# EAGLE design aprs_tracker_v4 (EAGLE 9.6.2)

## Sheet 1 of 2
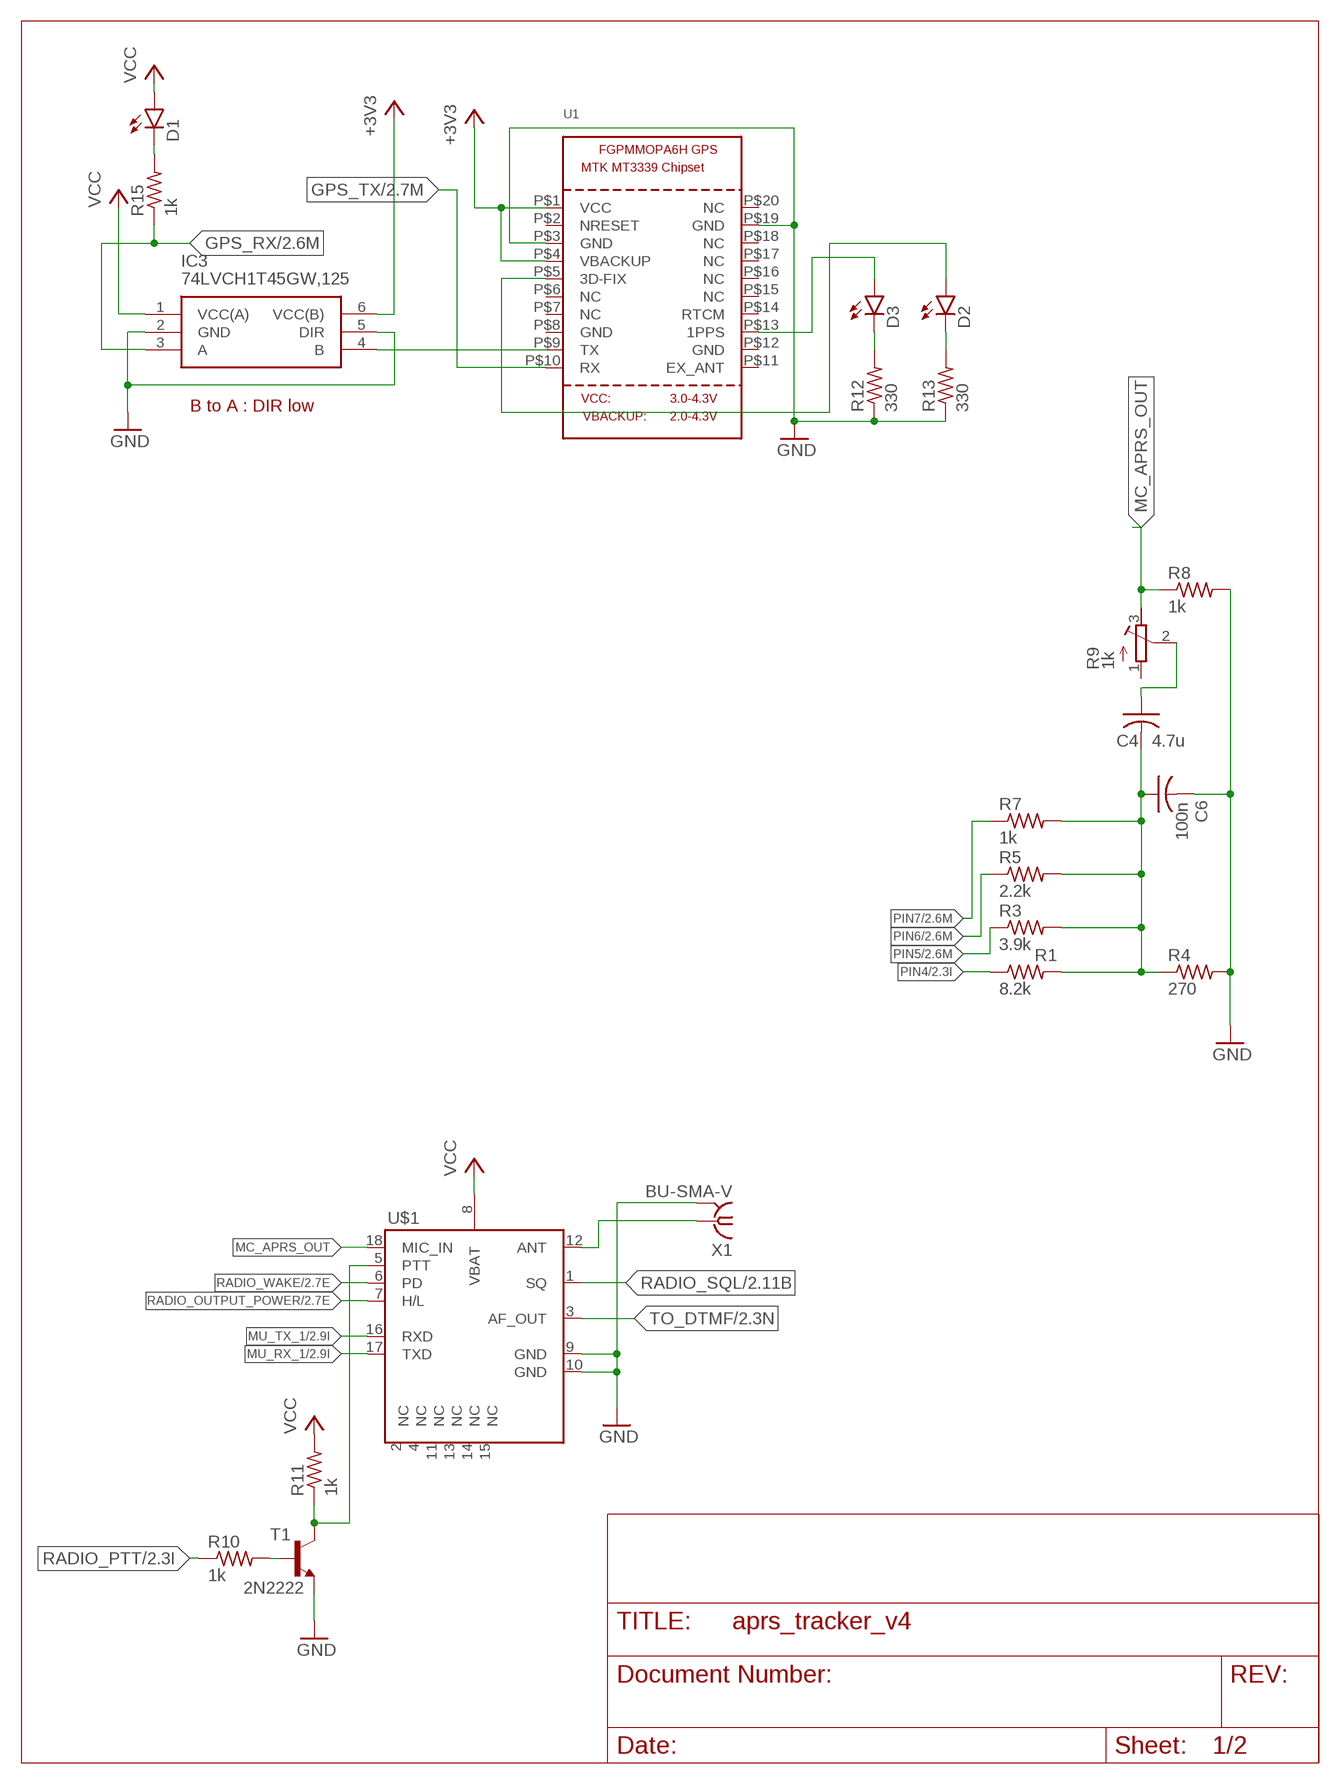
[diagram p0: schematic, sheet 1]

### Parts
C4  4.7u  C-USC0805  [C0805]
C6  100n  C-USC0805  [C0805]
D1  LEDCHIP-LED0805  [CHIP-LED0805]
D2  LEDCHIP-LED0805  [CHIP-LED0805]
D3  LEDCHIP-LED0805  [CHIP-LED0805]
IC3  74LVCH1T45GW,125  [74LVCH1T45GW125]
R1  8.2k  R-US_R0805  [R0805]
R3  3.9k  R-US_R0805  [R0805]
R4  270  R-US_R0805  [R0805]
R5  2.2k  R-US_R0805  [R0805]
R7  1k  R-US_R0805  [R0805]
R8  1k  R-US_R0805  [R0805]
R9  1k  R-TRIMM3339P  [RTRIM3339P]
R10  1k  R-US_R0805  [R0805]
R11  1k  R-US_R0805  [R0805]
R12  330  R-US_R0805  [R0805]
R13  330  R-US_R0805  [R0805]
R15  1k  R-US_R0805  [R0805]
T1  2N2222  [TO92-EBC-OVAL]
U1  GPS_FGPMMOPA6H  [FGPMMOPA6H]
U$1  DRA818A  [DRA818A]
X1  BU-SMA-V  [BU-SMA-V]

### Nets
+3V3 [PWR]: IC3.6(VCC(B)) U1.P$1(VCC) U1.P$4(VBACKUP) ; also sheet 2
A63: D2.A U1.P$5(3D-FIX)
GND [V_bat]: C6.2 IC3.2(GND) IC3.5(DIR) R4.2 R8.2 R12.1 R13.1 T1.E U1.P$3(GND) U1.P$19(GND) U$1.9(GND) U$1.10(GND) X1.2 X1.3 X1.4 X1.5 ; also sheet 2
GPS_RX: IC3.3(A) R15.1 ; also sheet 2
GPS_TX: U1.P$10(RX) ; also sheet 2
MC_APRS_OUT: R8.1 R9.3(E) U$1.18(MIC_IN)
MU_RX_1: U$1.17(TXD) ; also sheet 2
MU_TX_1: U$1.16(RXD) ; also sheet 2
N$1 [50 ohm]: U$1.12(ANT) X1.1
N$3: D1.C R15.2
N$4: IC3.4(B) U1.P$9(TX)
N$10: C4.2 C6.1 R1.2 R3.2 R4.1 R5.2 R7.2
N$11: C4.1 R9.2(S)
N$12: R11.1 T1.C U$1.5(PTT)
N$14: R10.2 T1.B
N$20: D3.C R12.2
N$21: D2.C R13.2
N$23: D3.A U1.P$13(1PPS)
PIN4: R1.1 ; also sheet 2
PIN5: R3.1 ; also sheet 2
PIN6: R5.1 ; also sheet 2
PIN7: R7.1 ; also sheet 2
RADIO_OUTPUT_POWER: U$1.7(H/L) ; also sheet 2
RADIO_PTT: R10.1 ; also sheet 2
RADIO_SQL: U$1.1(SQ) ; also sheet 2
RADIO_WAKE: U$1.6(PD) ; also sheet 2
TO_DTMF: U$1.3(AF_OUT) ; also sheet 2
VCC [PWR]: D1.A IC3.1(VCC(A)) R11.2 U$1.8(VBAT) ; also sheet 2
Unconnected: R9.1(A) U1.P$2(NRESET) U1.P$6(NC) U1.P$7(NC) U1.P$8(GND) U1.P$11(EX_ANT) U1.P$12(GND) U1.P$14(RTCM) U1.P$15(NC) U1.P$16(NC) U1.P$17(NC) U1.P$18(NC) U1.P$20(NC) U$1.2(NC) U$1.4(NC) U$1.11(NC) U$1.13(NC) U$1.14(NC) U$1.15(NC)

### Notes on the sheet
- B to A : DIR low

## Sheet 2 of 2
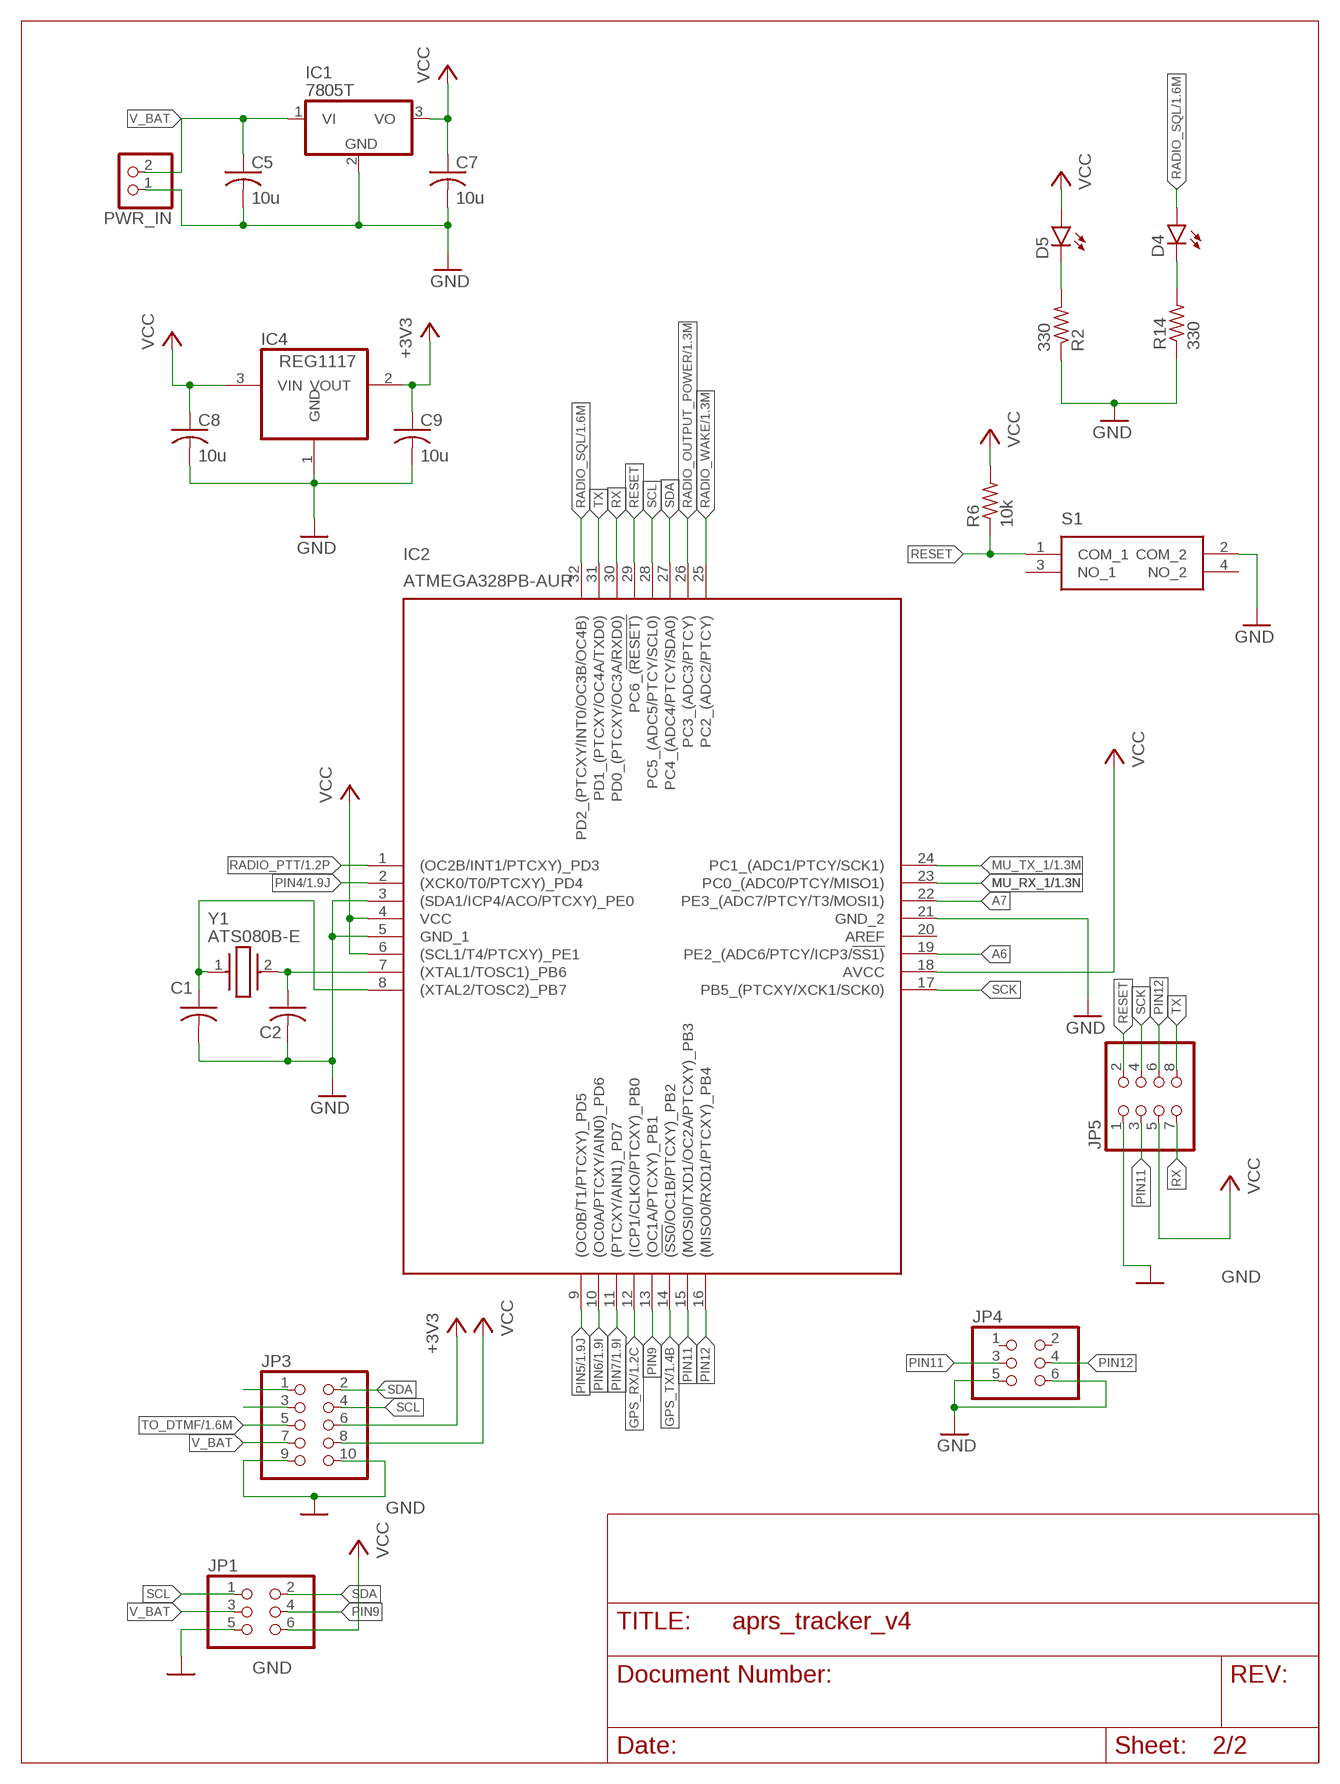
[diagram p1: schematic, sheet 2]

### Parts
C1  C-USC0805  [C0805]
C2  C-USC0805  [C0805]
C5  10u  C-USC0805  [C0805]
C7  10u  C-USC0805  [C0805]
C8  10u  C-USC0805  [C0805]
C9  10u  C-USC0805  [C0805]
D4  LEDCHIP-LED0805  [CHIP-LED0805]
D5  LEDCHIP-LED0805  [CHIP-LED0805]
IC1  7805T  [TO220H]
IC2  ATMEGA328PB-AUR  [QFP80P900X900X120-32N]
IC4  REG1117  [SOT223]
JP1  PINHD-2X3/90  [2X03/90]
JP3  PINHD-2X5  [2X05]
JP4  PINHD-2X3/90  [2X03/90]
JP5  PINHD-2X4  [2X04]
PWR_IN  PINHD-1X2/90  [1X02/90]
R2  330  R-US_R0805  [R0805]
R6  10k  R-US_R0805  [R0805]
R14  330  R-US_R0805  [R0805]
S1  PTS526_SK15_SMTR2_LFS  [PTS526SK15SMTR2LFS]
Y1  ATS080B-E  [ATS080BE]

### Nets
+3V3 [PWR]: C9.1 IC4.2(VOUT) JP3.6 ; also sheet 1
A6: IC2.19(PE2_(ADC6/PTCY/ICP3/!SS1))
A7: IC2.22(PE3_(ADC7/PTCY/T3/MOSI1))
GND [V_bat]: C1.2 C2.2 C5.2 C7.2 C8.2 C9.2 IC1.2(GND) IC2.3((SDA1/ICP4/ACO/PTCXY)_PE0) IC2.5(GND_1) IC2.21(GND_2) IC4.1(GND) JP1.5 JP3.9 JP3.10 JP4.5 JP4.6 JP5.1 PWR_IN.1 R2.1 R14.1 S1.2(COM_2) ; also sheet 1
GPS_RX: IC2.12((ICP1/CLKO/PTCXY)_PB0) ; also sheet 1
GPS_TX: IC2.14((!SS0!/OC1B/PTCXY)_PB2) ; also sheet 1
MU_RX_1: IC2.23(PC0_(ADC0/PTCY/MISO1)) ; also sheet 1
MU_TX_1: IC2.24(PC1_(ADC1/PTCY/SCK1)) ; also sheet 1
N$5: D5.C R2.2
N$6: C1.1 IC2.8((XTAL2/TOSC2)_PB7) Y1.1
N$7: C2.1 IC2.7((XTAL1/TOSC1)_PB6) Y1.2
N$17: JP3.3
N$22: D4.C R14.2
N$25: JP3.1
PIN4: IC2.2((XCK0/T0/PTCXY)_PD4) ; also sheet 1
PIN5: IC2.9((OC0B/T1/PTCXY)_PD5) ; also sheet 1
PIN6: IC2.10((OC0A/PTCXY/AIN0)_PD6) ; also sheet 1
PIN7: IC2.11((PTCXY/AIN1)_PD7) ; also sheet 1
PIN9: IC2.13((OC1A/PTCXY)_PB1) JP1.4
PIN11: IC2.15((MOSI0/TXD1/OC2A/PTCXY)_PB3) JP4.3 JP5.3
PIN12: IC2.16((MISO0/RXD1/PTCXY)_PB4) JP4.4 JP5.6
RADIO_OUTPUT_POWER: IC2.26(PC3_(ADC3/PTCY)) ; also sheet 1
RADIO_PTT: IC2.1((OC2B/INT1/PTCXY)_PD3) ; also sheet 1
RADIO_SQL: D4.A IC2.32(PD2_(PTCXY/INT0/OC3B/OC4B)) ; also sheet 1
RADIO_WAKE: IC2.25(PC2_(ADC2/PTCY)) ; also sheet 1
RESET: IC2.29(PC6_(!RESET)) JP5.2 R6.1 S1.1(COM_1)
RX: IC2.30(PD0_(PTCXY/OC3A/RXD0)) JP5.7
SCK: IC2.17(PB5_(PTCXY/XCK1/SCK0)) JP5.4
SCL: IC2.28(PC5_(ADC5/PTCY/SCL0)) JP1.1 JP3.4
SDA: IC2.27(PC4_(ADC4/PTCY/SDA0)) JP1.2 JP3.2
TO_DTMF: JP3.5 ; also sheet 1
TX: IC2.31(PD1_(PTCXY/OC4A/TXD0)) JP5.8
V_BAT [PWR]: C5.1 IC1.1(VI) JP1.3 JP3.7 PWR_IN.2
VCC [PWR]: C7.1 C8.1 D5.A IC1.3(VO) IC2.4(VCC) IC2.6((SCL1/T4/PTCXY)_PE1) IC2.18(AVCC) IC4.3(VIN) JP1.6 JP3.8 JP5.5 R6.2 ; also sheet 1
Unconnected: IC2.20(AREF) JP4.1 JP4.2 S1.3(NO_1) S1.4(NO_2)

## Library data of the parts
C1 C2 C4-C9 = rcl:C-US: CAPACITOR, American symbol; SPICEPREFIX: C
D1-D5 = led:LED: LED OSRAM: - CHIPLED LG R971, LG N971, LY N971, LG Q971, LY Q971, LO R971, LY R971 LH N974, LH R974 LS Q976, LO Q976, LY Q976 LO Q996 - Hyper CHIPLED LW Q18S LB Q993, LB Q99A, LB R99A - SideLED LS A670, LO A670, LY A670, LG A670, LP A670 LB A673, LV A673, LT A673, LW A673 LH A674 LY A675 LS A676, LA A676, LO A676, LY A676, LW A676 LS A679, LY A679, LG A679 - Hyper Micro SIDELED® LS Y876, LA Y876, LO Y876, LY Y876 LT Y87S - SmartLED LW L88C, LW L88S LB L89C, LB L89S, LG L890 LS L89K, LO L89K, LY L89K LS L896, LA L896, LO L896, LY L896 - TOPLED LS T670, LO T670, LY T670, LG T670, LP T670 LSG T670, LSP T670, LSY T670, LOP T670, LYG T670 LG T671, LOG T671, LSG T671 LB T673, LV T673, LT T673, LW T673 LH T674 LS T676, LA T676, LO T676, LY T676, LB T676, LH T676, LSB T676, LW T676 LB T67C, LV T67C, LT T67C, LS T67K, LO T67K, LY T67K, LW E67C LS E67B, LA E67B, LO E67B, LY E67B, LB E67C, LV E67C, LT E67C LW T67C LS T679, LY T679, LG T679 LS T770, LO T770, LY T770, LG T770, LP T770 LB T773, LV T773, LT T773, LW T773 LH T774 LS E675, LA E675, LY E675, LS T675 LS T776, LA T776, LO T776, LY T776, LB T776 LHGB T686 LT T68C, LB T68C - Hyper Mini TOPLED® LB M676 - Mini TOPLED Santana® LG M470 LS M47K, LO M47K, LY M47K Source: http://www.osram.convergy.de LUXEON: - LUMILED® LXK2-PW12-R00, LXK2-PW12-S00, LXK2-PW14-U00, LXK2-PW14-V00 LXK2-PM12-R00, LXK2-PM12-S00, LXK2-PM14-U00 LXK2-PE12-Q00, LXK2-PE12-R00, LXK2-PE12-S00, LXK2-PE14-T00, LXK2-PE14-U00 LXK2-PB12-K00, LXK2-PB12-L00, LXK2-PB12-M00, LXK2-PB14-N00, LXK2-PB14-P00, LXK2-PB14-Q00 LXK2-PR12-L00, LXK2-PR12-M00, LXK2-PR14-Q00, LXK2-PR14-R00 LXK2-PD12-Q00, LXK2-PD12-R00, LXK2-PD12-S00 LXK2-PH12-R00, LXK2-PH12-S00 LXK2-PL12-P00, LXK2-PL12-Q00, LXK2-PL12-R00 Source: www.luxeon.com KINGBRIGHT: KA-3528ASYC Source: www.kingbright.com
IC1 = adafruit:78*: Positive VOLTAGE REGULATOR Added bigger pads to the TO-92 package
IC2 = ATMEGA328PB-AUR:ATMEGA328PB-AUR: 8-bit Microcontrollers - MCU ATMEGA328PB IND TEMP T&R Source: Datasheet <http://www.atmel.com/Images/Atmel-42397-8-bit-AVR-Microcontroller-ATmega328PB_Summary.pdf>; DESCRIPTION: 8-bit Microcontrollers - MCU ATMEGA328PB IND TEMP T&R; HEIGHT: 1.2mm; MANUFACTURER_NAME: Microchip; MANUFACTURER_PART_NUMBER: ATMEGA328PB-AUR; MOUSER_PART_NUMBER: 556-ATMEGA328PB-AUR; MOUSER_PRICE-STOCK: https://www.mouser.co.uk/ProductDetail/Microchip-Technology/ATMEGA328PB-AUR?qs=jy4bLUHv09i4S8%252BfUeCffg%3D%3D
IC3 = 74LVCH1T45GW_125:74LVCH1T45GW,125: 74LVC1T45; 74LVCH1T45 - Dual supply translating transceiver; 3-state@en-us Source: Datasheet <https://assets.nexperia.com/documents/data-sheet/74LVC_LVCH1T45.pdf>; DESCRIPTION: 74LVC1T45; 74LVCH1T45 - Dual supply translating transceiver; 3-state@en-us; HEIGHT: 1.1mm; MANUFACTURER_NAME: Nexperia; MANUFACTURER_PART_NUMBER: 74LVCH1T45GW,125; MOUSER_PART_NUMBER: 771-74LVCH1T45GW125; MOUSER_PRICE-STOCK: https://www.mouser.co.uk/ProductDetail/Nexperia/74LVCH1T45GW125?qs=jquClx72t9DcZPG2mG4TEQ%3D%3D
IC4 = burr-brown:REG1117: 800mA and 1A Low Dropout (LDO) Positive Regulator 1.8V, 2.5V, 2.85V, 3.3V, 5V, and Adj; MPN: REG1117; OC_FARNELL: 1097566; OC_NEWARK: 14P6981
JP1 JP4 = pinhead:PINHD-2X3: PIN HEADER
JP3 = pinhead:PINHD-2X5: PIN HEADER
JP5 = pinhead:PINHD-2X4: PIN HEADER
PWR_IN = pinhead:PINHD-1X2: PIN HEADER
R1-R8 R10-R15 = rcl:R-US_: RESISTOR, American symbol; SPICEPREFIX: R
R9 = rcl:R-TRIMM: Trimm resistor; SPICEMODEL: X; SPICEPREFIXL: POT
S1 = PTS526_SK15_SMTR2_LFS:PTS526_SK15_SMTR2_LFS: Tact 5.2 x 5.2, 1.5 mm H, 260gf, G leads, No ground pin, metal actuator Source: Datasheet <https://www.ckswitches.com/media/2780/pts526.pdf>; DESCRIPTION: Tact 5.2 x 5.2, 1.5 mm H, 260gf, G leads, No ground pin, metal actuator; HEIGHT: 1.65mm; MANUFACTURER_NAME: C & K COMPONENTS; MANUFACTURER_PART_NUMBER: PTS526 SK15 SMTR2 LFS; MOUSER_PART_NUMBER: 611-PTS526SK15SMR2L; MOUSER_PRICE-STOCK: https://www.mouser.co.uk/ProductDetail/CK/PTS526-SK15-SMTR2-LFS?qs=UXgszm6BlbF5Ezp94JAQtw%3D%3D
T1 = adafruit:2N2222: NPN TRANSISTOR Big oval pads
U1 = adafruit:GPS_FGPMMOPA6H: GPS Module - MTK MT3339 Chipset, -165dBm sensitivity, 22 channels, 10Hz, auto-select external antenna options
U$1 = dorji:DRA818A
X1 = con-coax:BU-SMA-V: FEMALE SMA CONNECTOR Radiall distributor RS 112-3794; OC_FARNELL: unknown; OC_NEWARK: unknown
Y1 = ATS080B-E:ATS080B-E: Crystals 8MHz 18pF Fund. -40C +85C Source: Datasheet; DESCRIPTION: Crystals 8MHz 18pF Fund. -40C +85C; HEIGHT: 3.68mm; MANUFACTURER_NAME: CTS; MANUFACTURER_PART_NUMBER: ATS080B-E; MOUSER_PART_NUMBER: 774-ATS080B-E; MOUSER_PRICE-STOCK: https://www.mouser.co.uk/ProductDetail/CTS-Electronic-Components/ATS080B-E?qs=EyvxYzk7Sd1vYvYpN4HpEw%3D%3D

## Net classes
0 default: width 0.229 mm, clearance 0.152 mm
1 PWR: width 0.254 mm, clearance 0.152 mm
2 V_bat: width 0.305 mm, clearance 0.152 mm
3 50 ohm: width 1.21 mm, clearance 0.26 mm

## Board
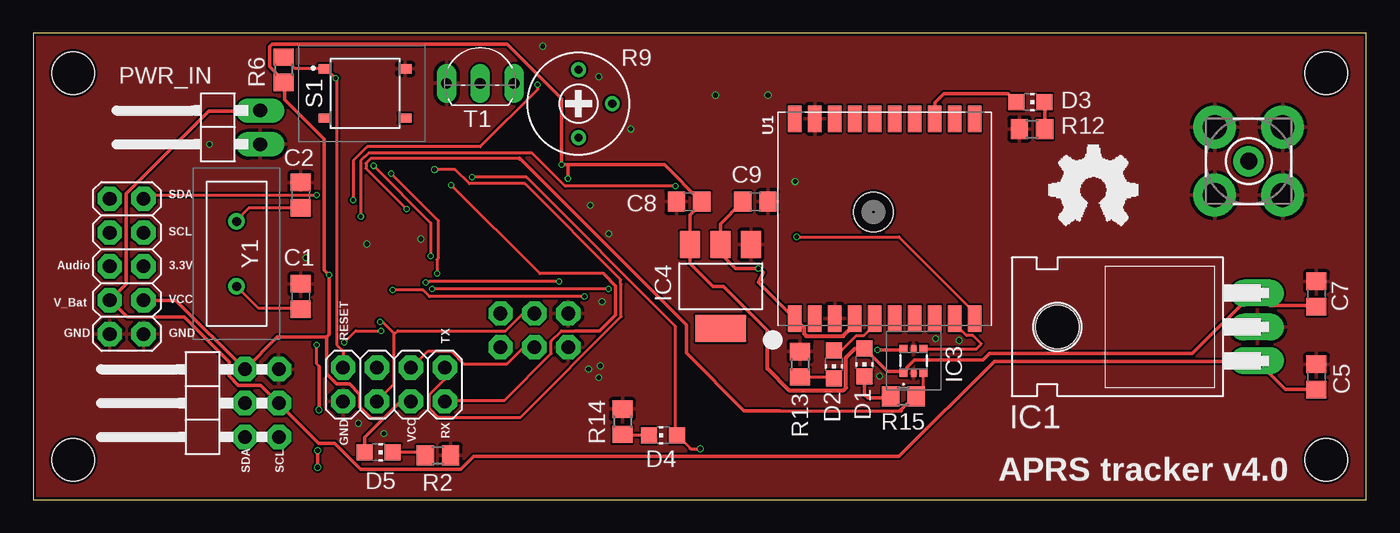
[diagram p2: board, top side]
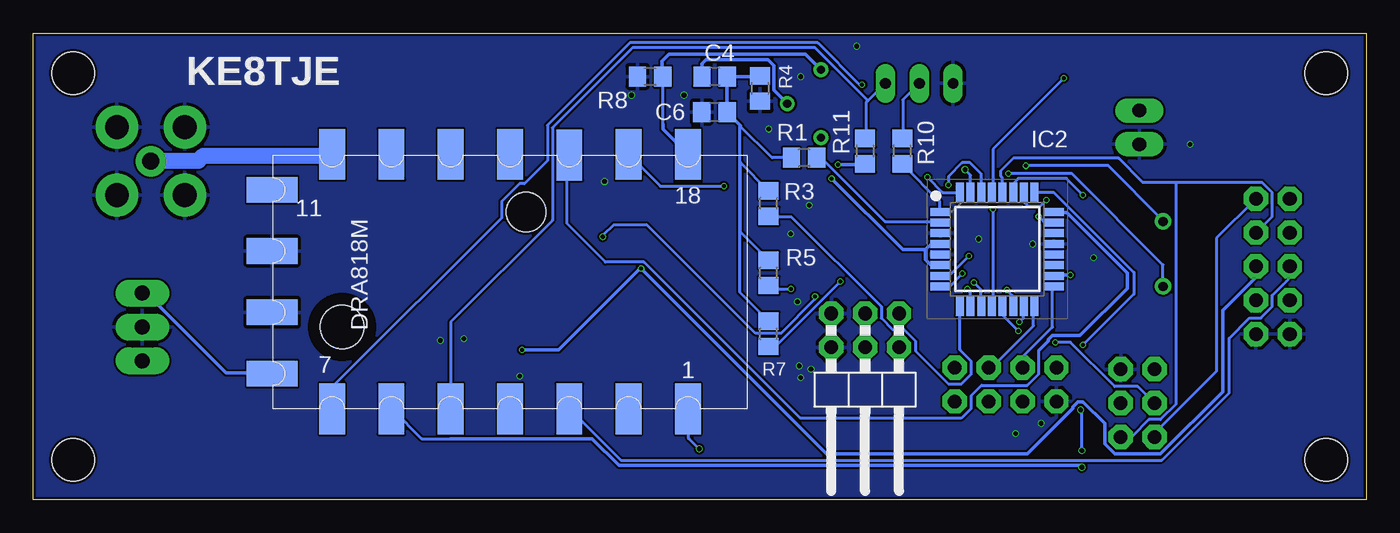
[diagram p3: board, bottom side, seen from below]

Size 100 x 35 mm. Coordinates in mm from the lower left corner, seen from the top.
Outline: 0,0 100,0 100,35 0,35 0,0
Copper layers (1*16): Top 0.035mm / dielectric 1.6mm / Bottom 0.035mm
Design rules "jlcpcb-2layers": minimum track width 5mil, minimum drill 0.3mm, track to track 5mil, track to pad 5mil, pad to pad 5mil, via to via 5mil, smd to smd 5mil, copper to edge 0.2mm, drill to drill 6mil, minimum pad ring 10mil, minimum via ring 3mil, stop-mask expansion 4mil, vias tented up to drill 0mil, thermal gap 10mil
Holes 3.2 mm at 3,32 3,3 97,32 97,3

### Footprints (pad centres in the part's own frame; a part is rotated, then mirrored left to right if it is on the bottom)
C0805 = smd 1.3 x 1.5: 1 -0.95,0; 2 0.95,0
CHIP-LED0805 = smd 1.2 x 1.2: A 0,-1.05; C 0,1.05
TO220H = drill 1.118 long: 1 -2.54,-10.16; 2 0,-10.16; 3 2.54,-10.16 | hole 3.302: 0,4.826
QFP80P900X900X120-32N = smd 1.5 x 0.6: 1 -4.25,2.8; 2 -4.25,2; 3 -4.25,1.2; 4 -4.25,0.4; 5 -4.25,-0.4; 6 -4.25,-1.2; 7 -4.25,-2; 8 -4.25,-2.8; 17 4.25,-2.8; 18 4.25,-2; 19 4.25,-1.2; 20 4.25,-0.4; 21 4.25,0.4; 22 4.25,1.2; 23 4.25,2; 24 4.25,2.8 | smd 0.6 x 1.5: 9 -2.8,-4.25; 10 -2,-4.25; 11 -1.2,-4.25; 12 -0.4,-4.25; 13 0.4,-4.25; 14 1.2,-4.25; 15 2,-4.25; 16 2.8,-4.25; 25 2.8,4.25; 26 2,4.25; 27 1.2,4.25; 28 0.4,4.25; 29 -0.4,4.25; 30 -1.2,4.25; 31 -2,4.25; 32 -2.8,4.25
74LVCH1T45GW125 = smd 0.6 x 0.6: 1 -0.9,0.75; 3 -0.9,-0.75; 4 0.9,-0.75; 6 0.9,0.75 | smd 0.6 x 0.4: 2 -0.9,0; 5 0.9,0
SOT223 = smd 1.499 x 2.007: 1 -2.261,-3.15; 2 0.025,-3.15; 3 2.311,-3.15 | smd 3.81 x 2.007: 4 0,3.15
2X03/90 = drill 1.016 octagon: 1 -2.54,-6.35; 2 -2.54,-3.81; 3 0,-6.35; 4 0,-3.81; 5 2.54,-6.35; 6 2.54,-3.81
2X05 = drill 1.016 octagon: 1 -5.08,-1.27; 2 -5.08,1.27; 3 -2.54,-1.27; 4 -2.54,1.27; 5 0,-1.27; 6 0,1.27; 7 2.54,-1.27; 8 2.54,1.27; 9 5.08,-1.27; 10 5.08,1.27
2X04 = drill 1.016 octagon: 1 -3.81,-1.27; 2 -3.81,1.27; 3 -1.27,-1.27; 4 -1.27,1.27; 5 1.27,-1.27; 6 1.27,1.27; 7 3.81,-1.27; 8 3.81,1.27
1X02/90 = drill 1.016 long: 1 -1.27,-3.81; 2 1.27,-3.81
R0805 = smd 1.3 x 1.5: 1 -0.95,0; 2 0.95,0
RTRIM3339P = drill 0.61: 1 -2.54,0; 2 0,-2.54; 3 2.54,0
PTS526SK15SMTR2LFS = smd 1 x 0.7: 1 -3,1.85; 2 3,1.85; 3 -3,-1.85; 4 3,-1.85
TO92-EBC-OVAL = drill 0.813 long: B 0,-1.27; C 2.54,-1.27; E -2.54,-1.27
FGPMMOPA6H = smd 2 x 1: P$1 -7.5,6.75; P$2 -7.5,5.25; P$3 -7.5,3.75; P$4 -7.5,2.25; P$5 -7.5,0.75; P$6 -7.5,-0.75; P$7 -7.5,-2.25; P$8 -7.5,-3.75; P$9 -7.5,-5.25; P$10 -7.5,-6.75; P$11 7.5,-6.75; P$12 7.5,-5.25; P$13 7.5,-3.75; P$14 7.5,-2.25; P$15 7.5,-0.75; P$16 7.5,0.75; P$17 7.5,2.25; P$18 7.5,3.75; P$19 7.5,5.25; P$20 7.5,6.75 | hole 3: 0.5,0.85
DRA818A = smd 3.81 x 1.93: 1 -9.45,-13.25; 2 -9.45,-8.8; 3 -9.45,-4.35; 4 -9.45,0.1; 5 -9.45,4.55; 6 -9.45,9; 7 -9.45,13.45; 12 9.65,13.45; 13 9.65,9; 14 9.65,4.55; 15 9.65,0.1; 16 9.6,-4.35; 17 9.65,-8.8; 18 9.65,-13.25 | smd 1.93 x 3.81: 8 -6.8,17.95; 9 -2.2,17.95; 10 2.4,17.95; 11 7,17.95
BU-SMA-V = drill 1.27: 1 0,0 | drill 1.778: 2 -2.55,2.55; 3 2.55,2.55; 4 2.55,-2.55; 5 -2.55,-2.55
ATS080BE = drill 0.68 pad 1.247: 1 0,0; 2 4.88,0

### Placement (x,y rotation side)
C1  20.07,15.24 90 top
C2  20.07,22.86 90 top
C4  48.88,31.75 0 bottom
C5  96.27,9.21 90 top
C6  48.9,29.08 180 bottom
C7  96.27,15.43 90 top
C8  49.21,22.35 180 top
C9  54.17,22.35 0 top
D1  62.36,10.29 180 top
D2  60.07,10.16 180 top
D3  74.8,29.84 270 top
D4  47.24,4.83 90 top
D5  25.91,3.56 270 top
IC1  81.66,12.95 90 top
IC2  27.69,18.8 0 bottom
IC3  66.04,10.41 90 top
IC4  51.58,16 180 top
JP1  12.06,7.24 90 top
JP3  7,17.5 270 top
JP4  37.59,7.62 180 bottom
JP5  27.05,8.64 0 top
PWR_IN  13.21,27.94 90 top
R1  42.16,25.65 180 bottom
R2  30.35,3.3 180 top
R3  44.83,22.23 90 bottom
R4  45.47,30.86 270 bottom
R5  44.83,17.02 90 bottom
R6  18.8,32.26 270 top
R7  44.83,12.45 90 bottom
R8  53.72,31.75 180 bottom
R9  40.89,29.72 90 top
R10  34.8,26.16 90 bottom
R11  37.59,26.16 270 bottom
R12  74.93,27.81 0 top
R13  57.53,10.16 270 top
R14  44.2,5.84 270 top
R15  65.28,7.75 180 top
S1  24.89,30.48 0 top
T1  33.53,32.51 0 top
U1  63.88,21.08 90 top
U$1  64.14,16.26 90 bottom
X1  91.19,25.4 0 top
Y1  15.24,16 90 top

### Tracks (layer width: path | path; a pad name or v marks a point on that pad's centre or on a via)
+3V3  (via drill 0.3)
  Top 0.254: C9.1 53.15,22.29 51.55,20.69 IC4.2 51.55,18.55 51.5,18.5 | v63.34,11.24 65.15,11.24 IC3.6 | U1.P$1 57.05,13.62 54.39,16.29 54.4,16.32 54.77,17.05 54.44,17.38 v54.39,17.34 52.66,17.34 51.5,18.5 | 61.63,14 61.63,13.62 | 51.5,18.5 51,19
  Top 0.305: U1.P$1 57.83,12.89 57.83,12.46 58.01,12.28 60.76,12.28 61.63,13.15 61.63,13.62 | U1.P$4 61.63,14
  Bottom 0.254: JP3.6 8.29,17.43 8.29,16.67 10.76,14.19 10.76,8.1 15.43,3.43 18.86,3.43 19.62,4.19 19.62,5.71 21.24,7.33 21.62,7.33 22,6.95 22,6.86 25.43,3.43 40.48,3.43 v54.39,17.34 54.48,17.34 60.58,11.24 v63.34,11.24
A63
  Top 0.229: D2.A 60.1,11.24 60.67,11.24 61.72,12.29 62.29,12.29 63.06,13.05 63.06,13.53 U1.P$5
GND  (via drill 0.35)
  Bottom 0.305: JP3.10 8.19,12.38 8.16,12.38 | 5.91,12.38 JP3.9
  other vias: 41.78,22.1 42.55,10.03 41.66,9.78 42.42,9.14 55.12,30.35 57.15,23.88 13.21,26.67 38.23,34.04 42.42,31.75 44.83,27.81 51.18,30.35 25.02,19.18 29.08,19.56 20.45,18.16 43.18,19.94 42.67,14.86 63.5,9.27 67.69,12.06 69.47,11.94 24.38,5.71 26.29,4.95
  pour Bottom: -2.67,39.5 101.6,39.5 101.6,-3.3 -2.67,-3.3
  pour Top: -2.03,38.48 101.22,38.48 101.22,-2.54 -2.16,-2.54 -2.16,38.48
GPS_RX  (via drill 0.3)
  Top 0.229: v28,21.81 24.96,24.86 24.96,25.24 25.34,25.62 36.48,25.62 36.48,25.53 | IC3.3 66.77,9.34 66.77,7.81 66.31,7.76 | 55.34,6.67 56,6.67 65.02,6.67 65.15,6.67
  Top 0.254: R15.1 | R15.1 66.31,7.76 | 65.02,6.67 65.07,6.72 65.09,6.72 66.13,7.76 R15.1 | 36.48,25.62 49,13.1 49,11 53.33,6.67 56,6.67
  Bottom 0.229: v28,21.81 28,14.57 IC2.12
GPS_TX  (via drill 0.3, 0.35)
  Top 0.229: v26.96,15.72 29.24,15.72 29.72,15.24 v41.34,15.24 | v57.28,19.72 64.96,19.72 70.58,14.1 70.58,13.62 U1.P$10
  Bottom 0.229: v26.96,15.72 26.57,15.34 26.57,14.57 IC2.14 | v41.34,15.24 41.34,15.05 43.91,12.48 45.81,12.48 53.96,20.62 56.47,20.62 57.28,19.81 v57.28,19.72
MC_APRS_OUT
  Bottom 0.229: 52.77,27.79 52.77,28.19 52.77,31.11 R8.1
  Bottom 0.254: 52.77,31.11 52.83,31.18 52.83,32.89 52.3,33.43 42.06,33.43 R9.3 | U$1.18 52.77,27.79 52.77,28.19
MU_RX_1  (via drill 0.3)
  Top 0.229: v24.57,21.24 24.57,25.43 25.15,26 37.43,26 39.91,23.53 v48.2,23.53
  Bottom 0.229: v24.57,21.24 24.19,20.86 23.53,20.86 IC2.23 | v48.2,23.53 52.96,23.53 55.24,25.81 U$1.17
MU_TX_1
  Bottom 0.229: 22.86,21.53 23.11,21.53 23.43,21.53 IC2.24 | 24.57,11.18 24.57,9.43 25.43,8.57 28.86,8.57 29.62,7.81 29.62,6.86 30.39,6.1 42.45,6.1 54.18,17.83 57.07,17.83 59.94,20.7 59.94,25.68 59.78,25.85 | 59.72,25.81 59.78,25.85 | 59.78,25.85 U$1.16
  Bottom 0.254: 24.57,11.18 23.84,11.91 23.84,12.02 23.54,12.32 21.46,12.32 17.93,15.85 17.93,16.99 22.46,21.53 23.11,21.53
N$1
  Bottom 1.21: U$1.12 77.63,25.81 87.25,25.81 87.63,25.43 91.15,25.43 X1.1
N$3
  Top 0.254: D1.C 62.36,7.87 62.61,7.62 64.2,7.62 R15.2
N$4
  Top 0.229: U1.P$9 69.06,13.53 69.06,13.05 69.29,13.05 70.02,12.31 70.49,12.31 71.12,11.68 70.75,11.31 IC3.4
N$5
  Top 0.229: D5.C 29.11,3.56 29.34,3.33 R2.2
N$6  (via drill 0.3)
  Top 0.229: Y1.1 16.86,14.38 20,14.38 C1.1 | v30.29,16.95 30.29,18 30.39,18.1 30.39,20.95 v26.86,24.48
  Bottom 0.229: v30.29,16.95 31.24,16 31.91,16 IC2.8 | v26.86,24.48 22.1,24.48 15.24,17.62 Y1.1
N$7  (via drill 0.3)
  Top 0.229: C2.1 20,21.91 16.19,21.91 15.24,20.95 Y1.2 | v29.81,18.29 29.81,20.77 v25.53,25.05
  Bottom 0.229: v29.81,18.29 31.24,16.86 31.91,16.86 IC2.7 | v25.53,25.05 19.34,25.05 15.24,20.95 Y1.2
N$10
  Bottom 0.229: R7.2 46.99,15.55 46.99,20.13 R5.2 | R3.2 46.96,25.3 46.99,25.33 46.99,28.07 46.93,28 44.58,25.65 R1.2
  Bottom 0.254: 46.99,20.13 46.99,25.27 46.96,25.3 | 46.93,28 46.93,28.06 C6.1 47.95,31.73 C4.2 45.53,31.75 R4.1
N$11
  Bottom 0.254: R9.2 44.44,30.72 44.44,32.58 44.88,33.02 49.53,33.02 49.83,32.72 C4.1
N$12
  Bottom 0.229: 37.39,29.96 36.1,31.24 T1.C | 37.39,29.96 37.53,29.81 37.53,27.15 R11.1 | 37.39,29.96 41.34,33.91 55.05,33.91 61.05,27.91 61.05,20.95 68.69,13.32 U$1.5
N$14
  Bottom 0.229: T1.B 34.77,30 34.77,27.15 R10.2
N$20
  Top 0.254: D3.C 75.88,29.82 R12.2
N$21
  Top 0.229: R13.2 59.97,9.21 D2.C
N$22
  Top 0.229: D4.C 46.1,4.86 44.2,4.86 R14.2
N$23
  Top 0.254: U1.P$13 67.63,29.79 68.33,30.48 73.12,30.48 D3.A
PIN4
  Bottom 0.229: IC2.2 32,20.86 36.1,20.86 40.86,25.62 41.15,25.62 R1.1
PIN5
  Bottom 0.229: IC2.9 30.48,14.48 30.48,11.24 29.62,10.38 29.62,9.43 30.39,8.67 31.34,8.67 33.81,11.14 33.81,11.91 34.67,12.76 35.53,12.76 36.39,13.62 36.39,14.48 43.15,21.24 44.77,21.24 R3.1
PIN6  (via drill 0.3)
  Top 0.229: v43.15,15.81 v29.91,15.81
  Bottom 0.229: v29.91,15.81 29.72,15.62 29.72,14.57 IC2.10 | v43.15,15.81 44.58,15.81 44.77,16 R5.1
PIN7  (via drill 0.3)
  Top 0.229: v29.43,16.29 29.62,16.29 29.72,16.38 v39.43,16.38
  Bottom 0.229: v29.43,16.29 28.96,15.81 28.96,14.57 IC2.11 | v39.43,16.38 44.29,11.53 44.77,11.53 R7.1
PIN9  (via drill 0.3)
  Top 0.229: v26.1,12.67 24.19,12.67 v23.34,11.81
  Bottom 0.229: v26.1,12.67 27.24,13.81 27.24,14.48 IC2.13 | v23.34,11.81 22.19,11.81 18.86,8.48 17.14,8.48 15.91,7.24 JP1.4
PIN11  (via drill 0.3)
  Top 0.229: v26,13.34 26.19,13.34 27.05,12.48 | 27.05,12.48 27.05,8.67 25.81,7.43 JP5.3 | JP4.3 37.53,13.91 36.67,13.91 35.43,12.67 27.34,12.67 27.15,12.48 27.05,12.48
  Bottom 0.229: v26,13.34 25.72,13.62 25.72,14.48 IC2.15
PIN12
  Top 0.229: JP4.4 36.77,11.43 35.53,10.19 32.29,10.19 31.34,11.14 29.62,11.14 28.38,9.91 JP5.6
  Bottom 0.229: JP5.6 28.1,9.91 24.96,13.05 24.96,14.48 IC2.16
RADIO_OUTPUT_POWER  (via drill 0.3)
  Top 0.229: v24,22.48 24,25.43 25.05,26.48 33.53,26.48 37.81,30.77 v37.81,31.15
  Bottom 0.229: v24,22.48 24.48,22 25.34,22 25.62,22.29 25.62,22.95 IC2.26 | v37.81,31.15 38.01,31.15 41.15,34.29 55.24,34.29 61.44,28.1 61.44,25.43 63.15,23.72 63.53,23.72 64.86,22.38 64.86,21.14 77.53,8.48 77.53,6.95 U$1.7
RADIO_PTT
  Bottom 0.229: IC2.1 32,21.62 32,22.38 34.77,25.15 R10.1
RADIO_SQL  (via drill 0.3, 0.35)
  Top 0.229: v50.04,3.81 49.31,3.81 49.24,3.9 48.39,4.76 D4.A 48.2,4.86 48.2,12.99 36.99,24.19 v32.92,24.19
  Bottom 0.229: v50.04,3.81 50.8,4.57 50.86,4.67 50.86,6.76 U$1.1 | v32.92,24.19 31.78,23.05 30.57,23.05 IC2.32
RADIO_WAKE  (via drill 0.3, 0.35)
  Top 0.229: v21.24,11.62 21.24,10.19 21.43,10
  Top 0.254: 21.43,10 v21.43,6.73 | v21.34,2.41 v21.34,3.68
  Bottom 0.229: v21.24,11.62 17.43,15.43 17.43,17.05 23.43,23.05 24.86,23.05 IC2.25 | 67.63,4.57 68.71,4.57 70.87,4.57 73.06,6.76 U$1.6 | v21.34,3.68 21.34,6.64 v21.43,6.73
  Bottom 0.254: 68.71,4.57 58.09,4.57 56.08,2.56 21.48,2.56 v21.34,2.41
RESET  (via drill 0.3)
  Top 0.229: R6.1 18.86,33.15 19.62,32.38 21.81,32.38 S1.1 22,32.29 v22.67,31.62 22.77,31.62 22.77,11.62 23.24,11.14 JP5.2
  Bottom 0.229: v22.67,31.62 28,26.29 28,23.05 IC2.29
RX  (via drill 0.3)
  Top 0.229: v31.34,23.62 38.01,16.95 42.77,16.95 | 40.64,12.67 39.62,12.67 38.86,11.91 38.86,10.95 35.34,7.43 30.86,7.43 JP5.7
  Top 0.254: 40.64,12.67 42.48,12.67 43.67,13.86 43.67,16.05 42.77,16.95
  Bottom 0.229: IC2.30 28.89,24.44 29.73,25.28 30.31,25.28 31.34,24.26 v31.34,23.62
SCK
  Bottom 0.229: IC2.17 23.53,15.91 23.53,12.95 25.72,10.76 25.72,9.91 JP5.4
SCL
  Bottom 0.229: 14.29,23.81 7.81,23.81 7.05,23.05 7.05,21.24 8.19,20.1 JP3.4 | 14.29,23.81 16.76,23.81 18.57,25.62 26.48,25.62 27.43,24.67 27.43,24.29 27.34,24.19 27.34,23.05 IC2.28 | 14.29,23.81 14.29,7.14 15.43,6 16.29,6 17.53,4.76 18.38,4.76 JP1.1
SDA  (via drill 0.3)
  Top 0.229: v21.24,22.86 8.48,22.86 8.29,22.67 JP3.2
  Bottom 0.229: v21.24,22.86 22.48,24.1 26.1,24.1 26.48,23.72 IC2.27 | JP1.2 15.81,4.76 15.81,5.05 11.24,9.62 11.24,19.62 8.29,22.57 JP3.2
TO_DTMF
  Bottom 0.229: JP3.5 5.81,17.43 5.81,16.57 7.05,15.34 7.05,14.48 7.91,13.62 8.76,13.62 10.29,12.1 10.29,8 15.34,2.95 55.91,2.95 59.72,6.76 U$1.3
TX  (via drill 0.35)
  Top 0.229: 30.86,9.04 29.68,7.86 29.68,6.88 30.37,6.18 36.56,6.18 44.1,13.73 44.1,16.16 44.07,16.19 44.07,16.51 36.88,23.7 32.72,23.7 31.66,24.77 v30.1,24.77
  Top 0.254: JP5.8 30.86,9.04
  Bottom 0.229: IC2.31 29.69,24.35 v30.1,24.77
V_BAT
  Top 0.254: C5.1 96.2,8.29 93.92,8.29 91.82,10.38 IC1.1 91.73,10.38 72.1,10.38 64.96,3.24 33.03,3.24 32.07,2.27 24.55,2.27 22.61,4.21 21.41,4.21 18.38,7.24 JP1.3 17.07,8.59 15.38,8.59 14.68,9.29 14.68,10.34 11.3,13.72 7.05,13.72 5.81,14.95 JP3.7 5.81,15.05 6.95,16.19 6.95,22.95 13.14,29.15 16.95,29.15 PWR_IN.2
VCC  (via drill 0.3)
  Top 0.254: 26.29,6.1 27.53,7.33 28.29,7.33 JP5.5 | 26.29,6.1 25.34,6.1 24.48,6.95 24.48,7.91 23.72,8.67 22.77,8.67 22,9.43 22,12.19 | C8.1 50.2,22.29 49.27,21.36 IC4.3 49.27,17.73 51,16 51.77,16 55.08,12.69 | 40.1,25.15 47.34,25.15 50.1,22.38 C8.1 | 40.1,25.15 v39.62,25.15 39.62,30.1 35.53,34.2 17.91,34.2 17.72,34 17.72,32.48 18.76,31.43 R6.2 18.86,31.24 18.86,30 21.81,27.05 21.81,17.24 v22.19,16.86 22.19,12.38 22,12.19 | 40.1,25.15 v40.1,24.1 | C7.1 96.2,14.57 92.77,14.57 91.92,15.43 IC1.3 91.82,15.43 91.44,15.43 86.96,10.95 71.72,10.95 71.25,10.48 66.11,10.48 65.56,9.93 65.56,9.79 IC3.1 65.25,9.62 64.07,9.62 D1.A | 50.29,22.29 C8.1 | 22,12.19 18.29,12.19 JP1.6 10.69,14.96 JP3.8 | D5.A 24.86,4.67 26.29,6.1
  Top 0.305: 55.08,12.69 55.08,9.83 56.7,8.21 60.8,8.21 60.98,8.38 60.98,10.67 61.65,11.34 D1.A
  Bottom 0.254: v22.19,16.86 23.43,16.86 IC2.18 | 33.05,18.76 33.05,18 32.67,17.62 32,17.62 IC2.6 | 33.05,18.76 32.67,19.14 32,19.14 IC2.4 | v39.62,25.15 37.62,25.15 R11.2 | 33.05,18.76 34.77,18.76 v40.1,24.1 | U$1.8 82.11,9.53 85.53,9.53 91.44,15.43 91.82,15.43 IC1.3

### Text on the board
tPlace: SDA | SCL | Audio | 3.3V | VCC | V_Bat | GND | GND
tNames: RESET | TX | RX | GND | VCC | SDA | SCL | APRS tracker v4.0
bNames: KE8TJE